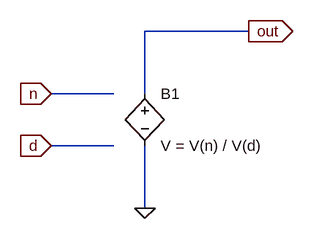
[diagram p0: schematic Divider.asc]
Divider.asc, the LTspice schematic file:
Version 4
SHEET 1 880 680
WIRE 640 32 480 32
WIRE 432 128 336 128
WIRE 480 128 480 32
WIRE 432 208 336 208
WIRE 480 304 480 208
FLAG 336 208 d
IOPIN 336 208 In
FLAG 336 128 n
IOPIN 336 128 In
FLAG 480 304 0
FLAG 640 32 out
IOPIN 640 32 Out
SYMBOL bv 480 112 R0
SYMATTR InstName B1
SYMATTR Value V = V(n) / V(d)

The netlist it stands for:
* Divider.asc
B1 out 0 V = V(n) / V(d)
.backanno
.end